# Altium schematic sheet Power_Reset.SchDoc: Power Input & Reset
size A4; DrawnBy: Samyar Sadat Akhavi; Revision: 1.0; SheetNumber: 2; SheetTotal: 5
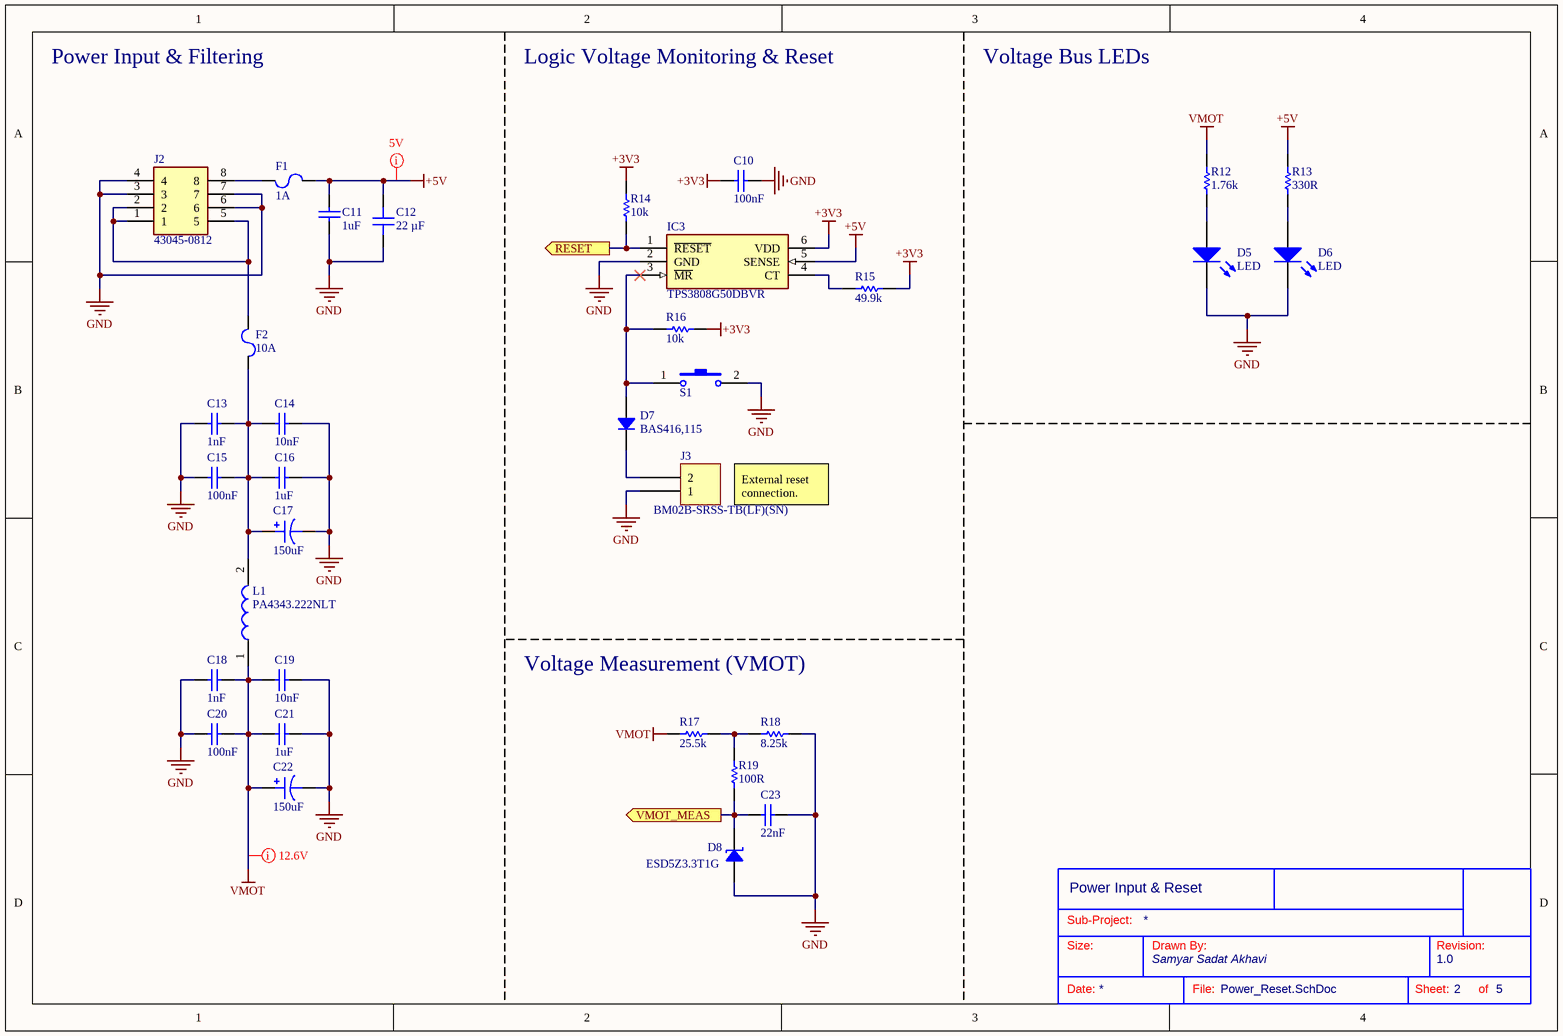
[diagram p0: Power_Reset.SchDoc]

## Parts
?  (no value)  (graphical)
C10  100nF  [CAP_SMD_603]
C11  1uF  [CAP_SMD_805]
C12  22 µF  [CAP 0805_2012]
C13  1nF  [CAP_SMD_603]
C14  10nF  [CAP_SMD_603]
C15  100nF  [CAP_SMD_603]
C16  1uF  [CAP_SMD_805]
C17  150uF  [CAP TH ALUM ELEC D6.30mm S2.50mm H12.50mm]
C18  1nF  [CAP_SMD_603]
C19  10nF  [CAP_SMD_603]
C20  100nF  [CAP_SMD_603]
C21  1uF  [CAP_SMD_805]
C22  150uF  [CAP TH ALUM ELEC D6.30mm S2.50mm H12.50mm]
C23  22nF  [CAP_SMD_603]
D5  LED  [LED_1206]
D6  LED  [LED_1206]
D7  BAS416,115  [SOD323 IPC]
D8  ESD5Z3.3T1G  [SOD523F]
F1  Current Rating (Amps): 1A  [FUSE 1206_3216 0.6MM]  (hidden comment: SF-1206F100-2)
F2  Current Rating (Amps): 10A  [FUSE 1206_3216 0.6MM]  (hidden comment: 3413.0328.22)
IC3  TPS3808G50DBVR  [SOT95P280X145-6N]
J2  43045-0812  [43045-08YY_121314]
J3  BM02B-SRSS-TB(LF)(SN)  [JST BM02B-SRSS-TB]
L1  PA4343.222NLT  [INDPM135125X650N]
R12  1.76k  [RES_0603]
R13  330R  [RES_0603]
R14  10k  [RES_0603]
R15  49.9k  [RES_0603]
R16  10k  [RES_0603]
R17  25.5k  [RES_0603]
R18  8.25k  [RES_0603]
R19  100R  [RES_0603]
S1  PTS815_SJK_250_SMTR_LFS  [PTS815SJK250SMTRLFS]  (value not drawn)

## Ports
RESET (out, see Motor_Control_Board[2B], Microcontroller[2A]), VMOT_MEAS (out, see Motor_Control_Board[2B], Microcontroller[3A])

## Nets
+3V3: C10.2 IC3.6(VDD) R14.2 R15.2 R16.2
+5V: C11.2 C12.2 F1.2 IC3.5(SENSE) R13.1
GND: C10.1 C11.1 C12.1 C13.2 C14.2 C15.2 C16.2 C17.2 C18.2 C19.2 C20.2 C21.2 C22.2 C23.1 D5.2(K) D6.2(K) D8.1 IC3.2(GND) J2.3 J2.4 J2.6 J2.7 J3.1 R18.2 S1.2(NO)
VMOT: C18.1 C19.1 C20.1 C21.1 C22.1 L1.1 R12.1 R17.1
RESET: IC3.1(~{RESET}) R14.1 ; port RESET
VMOT_MEAS: C23.2 D8.2 R19.2 ; port VMOT_MEAS
NetC13_1: C13.1 C14.1 C15.1 C16.1 C17.1 F2.1 L1.2
NetD5_1: D5.1(A) R12.2
NetD6_1: D6.1(A) R13.2
NetD7_1: D7.1 J3.2
NetD7_2: D7.2 IC3.3(~{MR}) R16.1 S1.1(COM)
NetF1_1: F1.1 J2.8
NetF2_2: F2.2 J2.1 J2.2 J2.5
NetIC3_4: IC3.4(CT) R15.1
NetR17_2: R17.2 R18.1 R19.1

## Layout directives
rule Supply Nets [Voltage = 5.000]; net class POWER: +5V
rule Supply Nets [Voltage = 12.60]; net class POWER: VMOT

## Notes on the sheet
- Power Input & Filtering
- Logic Voltage Monitoring & Reset
- Voltage Bus LEDs
- External reset connection.
- Voltage Measurement (VMOT)
- Sub-Project:
- Size:
- Drawn By:
- Revision:
- Date:
- File:
- Sheet:
- of

## Library data of the parts
? = Standard Title Block
C10 C23 = Non-polar Capacitor: Generic Ceramic Capacitor; Voltage: 6.3V
  C10: Value: 100nF
  C23: Value: 22nF
C11 C13-C16 C18-C21 = Non-polar Capacitor: Generic Ceramic Capacitor; Voltage: 16V
  C11 C16 C21: Value: 1uF
  C13 C18: Value: 1nF
  C14 C19: Value: 10nF
  C15 C20: Value: 100nF
C12 = CL21A226MAYNNNE: CAP CER 22UF 25V X5R 0805; manufacturer: Samsung Electro-Mechanics; Tolerance: ±20%; Part Number: CL21A226MAYNNNE; Capacitance: 22 µF; Applications: General Purpose; componentlink1description: Datasheet; componentlink1url: https://media.digikey.com/pdf/Data%20Sheets/Samsung%20PDFs/CL21A226MAYNNNE_Spec.pdf; componentlink2description: DigiKey Link; componentlink2url: https://www.digikey.com/en/products/detail/samsung-electro-mechanics/CL21A226MAYNNNE/10479857; Device Package: 0805 (2012 Metric); lastupdated: 2/9/2024 8:15:02 PM; Lifecycle Status: Active; Minimum Order: 1; Mounting Type: Surface Mount, MLCC; Operating Temperature: -55°C ~ 85°C; Package / Case: 0805 (2012 Metric); packaging: TapeAndReel; partid: 39209; Part Status: Active; price: 0.04; series: CL; Size / Dimension: 0.079" L x 0.049" W (2.00mm x 1.25mm); Supplier 1: DigiKey; Supplier Part Number 1: 1276-CL21A226MAYNNNECT-ND; Temperature Coefficient: X5R; Thickness (Max): 0.057" (1.45mm); value: 22 µF; Voltage - Rated: 25V
C17 C22 = 860020373008: CAP ALUM 150UF 20% 16V RADIAL; manufacturer: Würth Elektronik; Lifetime @ Temp.: 2000 Hrs @ 105°C; Polarization: Polar; Ripple Current @ High Frequency: 234.6mA @ 100kHz; Ripple Current @ Low Frequency: 170mA @ 120Hz; Part Number: 860020373008; Applications: General Purpose; Capacitance: 150uF; componentlink1description: Datasheet; componentlink1url: https://katalog.we-online.de/pbs/datasheet/860020373008.pdf; componentlink2description: DigiKey Link; componentlink2url: http://digikey.com/product-detail/en/w-rth-elektronik/860020373008/732-8795-1-ND/5728740; Device Package: Radial, Can; Height - Seated (Max): 0.492" (12.50mm); lastupdated: 9/4/2020 1:05:50 AM; Lead Spacing: 0.098" (2.50mm); Lifecycle Status: Active; Minimum Order: 1; Mounting Type: Through Hole; Operating Temperature: -40°C ~ 105°C; Package / Case: Radial, Can; packaging: TapeAndBox; partid: 21016; Part Status: Active; price: 0.07; series: WCAP-ATG5; Size / Dimension: 0.248" Dia (6.30mm); Supplier 1: DigiKey; Supplier Part Number 1: 732-8795-1-ND; Tolerance: ±20%; value: 150uF; Voltage - Rated: 16V
D5 D6 = LED: Indicator LED; Color: Blue
D7 = BAS416,115: DIODE STANDARD 75V 200MA SOD323; Manufacturer: Nexperia USA Inc.; Capacitance @ Vr, F: 2pF @ 0V, 1MHz; Current - Reverse Leakage @ Vr: 5 nA @ 75 V; Reverse Recovery Time (trr): 3 µs; Speed: Small Signal =< 200mA (Io), Any Speed; Voltage - Forward (Vf) (Max) @ If: 1.25 V @ 150 mA; Part Number: BAS416,115; ComponentLink1Description: Datasheet; ComponentLink1URL: https://assets.nexperia.com/documents/data-sheet/BAS416.pdf; ComponentLink2Description: DigiKey Link; ComponentLink2URL: https://www.digikey.com/en/products/detail/nexperia-usa-inc/BAS416-115/1232094; Current - Average Rectified (Io): 200mA; Diode Type: Standard; LastUpdated: 10/27/2025 1:55:14 PM; Lifecycle Status: Active; Minimum Order: 1; Mounting Type: Surface Mount; Operating Temperature - Junction: 150°C (Max); Package / Case: SC-76, SOD-323; Packaging: TapeAndReel; PartId: 2951; Part Status: Active; Price: 0.02; Series: -; Supplier 1: DigiKey; Supplier Part Number 1: 1727-4807-1-ND; Supplier Device Package: SOD-323; Voltage - DC Reverse (Vr) (Max): 75 V
D8 = ESD5Z3.3T1G: TVS DIODE 3.3V 14.1V SOD523; Manufacturer: ON Semiconductor; Capacitance @ Frequency: 105pF @ 1MHz; Current - Peak Pulse (10/1000µs): 11.2A (8/20µs); Power Line Protection: No; Power - Peak Pulse: 158W; Type: Zener; Unidirectional Channels: 1; Voltage - Breakdown (Min): 5V; Voltage - Reverse Standoff (Typ): 3.3V (Max); Part Number: ESD5Z3.3T1G; Applications: General Purpose; ComponentLink1Description: Datasheet; ComponentLink1URL: https://www.onsemi.com/pub/Collateral/ESD5Z2.5T1-D.PDF; ComponentLink2Description: DigiKey Link; ComponentLink2URL: http://digikey.com/product-detail/en/on-semiconductor/ESD5Z3.3T1G/ESD5Z3.3T1GOSCT-ND/1967044; LastUpdated: 6/3/2024 8:22:18 PM; Lifecycle Status: Active; Minimum Order: 1; Mounting Type: Surface Mount; Operating Temperature: -55°C ~ 150°C (TJ); Package / Case: SC-79, SOD-523; Packaging: TapeAndReel; PartId: 9754; Part Status: Active; Price: 0.04; Series: -; Supplier 1: DigiKey; Supplier Part Number 1: ESD5Z3.3T1GOSCT-ND; Supplier Device Package: SOD-523; Voltage - Clamping (Max) @ Ipp: 14.1V
F1 = SF-1206F100-2: FUSE BOARD MOUNT 1A 63VDC 1206; Manufacturer: Bourns Inc.; Approval Agency: UL; Breaking Capacity @ Rated Voltage: 50A; Fuse Type: Board Mount (Cartridge Style Excluded); Melting I²t: 0.034; Response Time: Fast Blow; Voltage Rating - DC: 63V; Part Number: SF-1206F100-2; Approvals: UL; ComponentLink1Description: Datasheet; ComponentLink1URL: https://www.bourns.com/pdfs/SF1206F.pdf; ComponentLink2Description: DigiKey Link; ComponentLink2URL: http://digikey.com/product-detail/en/bourns-inc/SF-1206F100-2/SF-1206F100-2CT-ND/1948202; Device Package: 1206 (3216 Metric); LastUpdated: 9/2/2020 1:30:42 AM; Lifecycle Status: Active; Minimum Order: 1; Mounting Type: Surface Mount; Operating Temperature: -40°C ~ 105°C; Package / Case: 1206 (3216 Metric); Packaging: TapeAndReel; Part Status: Active; Price: 0.31; Series: SinglFuse™ SF-1206F; Size / Dimension: 0.122" L x 0.061" W x 0.024" H (3.10mm x 1.55mm x 0.60mm); Supplier 1: DigiKey; Supplier Part Number 1: SF-1206F100-2CT-ND
F2 = 3413.0328.22: FUSE BOARD MOUNT 10A 32VAC 63VDC; Manufacturer: Schurter Inc.; Approval Agency: cURus; Breaking Capacity @ Rated Voltage: 100A; Fuse Type: Board Mount (Cartridge Style Excluded); Melting I²t: 21; Response Time: Slow Blow; Voltage Rating - AC: 32V; Voltage Rating - DC: 63V; Part Number: 3413.0328.22; Approvals: cURus; ComponentLink1Description: Datasheet; ComponentLink1URL: https://us.schurter.com/pdf/english/typ_UST_1206.pdf; ComponentLink2Description: DigiKey Link; ComponentLink2URL: http://digikey.com/product-detail/en/schurter-inc/3413.0328.22/486-1686-1-ND/2870095; Device Package: 1206 (3216 Metric); LastUpdated: 9/2/2020 1:30:41 AM; Lifecycle Status: Active; Minimum Order: 1; Mounting Type: Surface Mount; Operating Temperature: -55°C ~ 90°C; Package / Case: 1206 (3216 Metric); Packaging: TapeAndReel; Part Status: Active; Price: 0.21; Series: UST 1206; Size / Dimension: 0.126" L x 0.063" W x 0.024" H (3.20mm x 1.60mm x 0.60mm); Supplier 1: DigiKey; Supplier Part Number 1: 486-1686-1-ND
IC3 = TPS3808G50DBVR: Integrated Circuit; Manufacturer_Name: Texas Instruments; Datasheet Link: http://www.ti.com/lit/gpn/tps3808; Height: 1.45mm; Manufacturer_Part_Number: TPS3808G50DBVR; Mouser Part Number: 595-TPS3808G50DBVR; Mouser Price/Stock: https://www.mouser.co.uk/ProductDetail/Texas-Instruments/TPS3808G50DBVR?qs=zwk82MlA57bbRDSNjc0z1g%3D%3D; Arrow Part Number: TPS3808G50DBVR; Arrow Price/Stock: https://www.arrow.com/en/products/tps3808g50dbvr/texas-instruments
J2 = 43045-0812: Connector; Manufacturer_Name: Molex; Datasheet Link: https://www.molex.com/pdm_docs/sd/430450612_sd.pdf; Height: 9.91mm; Manufacturer_Part_Number: 43045-0812; Mouser Part Number: 538-43045-0812; Mouser Price/Stock: https://www.mouser.co.uk/ProductDetail/Molex/43045-0812?qs=qjii0NTOo%252B4%252BsykjI9icjA%3D%3D; Arrow Part Number: 43045-0812; Arrow Price/Stock: https://www.arrow.com/en/products/43045-0812/molex?region=nac; System: Connector
J3 = BM02B-SRSS-TB(LF)(SN): CONN HEADER SMD 2POS 1MM; Manufacturer: JST Sales America Inc.; Current Rating (Amps): 0.7A; Material Flammability Rating: UL94 V-0; Number of Positions: 2; Number of Positions Loaded: All; Pitch - Mating: 0.039" (1.00mm); Shrouding: Shrouded - 4 Wall; Style: Board to Cable/Wire; Voltage Rating: 50V; Part Number: BM02B-SRSS-TB(LF)(SN); ComponentLink1Description: Datasheet; ComponentLink1URL: http://www.jst-mfg.com/product/pdf/eng/eSR.pdf; ComponentLink2Description: DigiKey Link; ComponentLink2URL: http://digikey.com/product-detail/en/jst-sales-america-inc/BM02B-SRSS-TB-LF-SN/455-1788-1-ND/926859; Connector Type: Header; Contact Finish - Mating: Tin; Contact Finish - Post: Tin; Contact Material: Copper Alloy; Contact Shape: Square; Contact Type: Male Pin; Fastening Type: Push-Pull; Features: Solder Retention; Insulation Color: Natural; Insulation Height: 0.167" (4.25mm); Insulation Material: Polyamide (PA), Nylon; LastUpdated: 1/12/2020 10:11:04 PM; Lifecycle Status: Active; Minimum Order: 1; Mounting Type: Surface Mount; Number of Rows: 1; Operating Temperature: -25°C ~ 85°C; Packaging: TapeAndReel; PartId: 12; Part Status: Active; Price: 0.22; Series: SR; Supplier 1: DigiKey; Supplier Part Number 1: 455-1788-1-ND; Termination: Solder
L1 = PA4343.222NLT: Inductor; Manufacturer_Name: YAGEO; Datasheet Link: https://productfinder.pulseelectronics.com/api/open/part-attachments/datasheet/PA4343.222NLT; Height: 6.5mm; Manufacturer_Part_Number: PA4343.222NLT; Mouser Part Number: 673-PA4343.222NLT; Mouser Price/Stock: https://www.mouser.co.uk/ProductDetail/Pulse-Electronics/PA4343222NLT?qs=%2FzQKu7YvIMbh7iiJmyUwAg%3D%3D; Arrow Part Number: PA4343.222NLT; Arrow Price/Stock: https://www.arrow.com/en/products/pa4343.222nlt/pulse-electronics-corporation
R12-R19 = Resistor: Power: 1/8W
  R12: Value: 1.76k
  R13: Value: 330R
  R14 R16: Value: 10k
  R15: Value: 49.9k
  R17: Value: 25.5k
  R18: Value: 8.25k
  R19: Value: 100R
S1 = PTS815_SJK_250_SMTR_LFS: Switch; Manufacturer_Name: C & K COMPONENTS; Manufacturer_Part_Number: PTS815 SJK 250 SMTR LFS; Datasheet Link: https://www.mouser.com/datasheet/2/60/pts815-1535658.pdf; Height: 2mm; Mouser Part Number: 611-PTS815SJK250SMTR; Mouser Price/Stock: https://www.mouser.co.uk/ProductDetail/CK/PTS815-SJK-250-SMTR-LFS?qs=ahcBuItHZ3yETpGYMHf%2FgQ%3D%3D; Arrow Part Number: PTS815 SJK 250 SMTR LFS; Arrow Price/Stock: https://www.arrow.com/en/products/pts815-sjk-250-smtr-lfs/ck